# EAGLE design LESR (EAGLE 9.5.2)
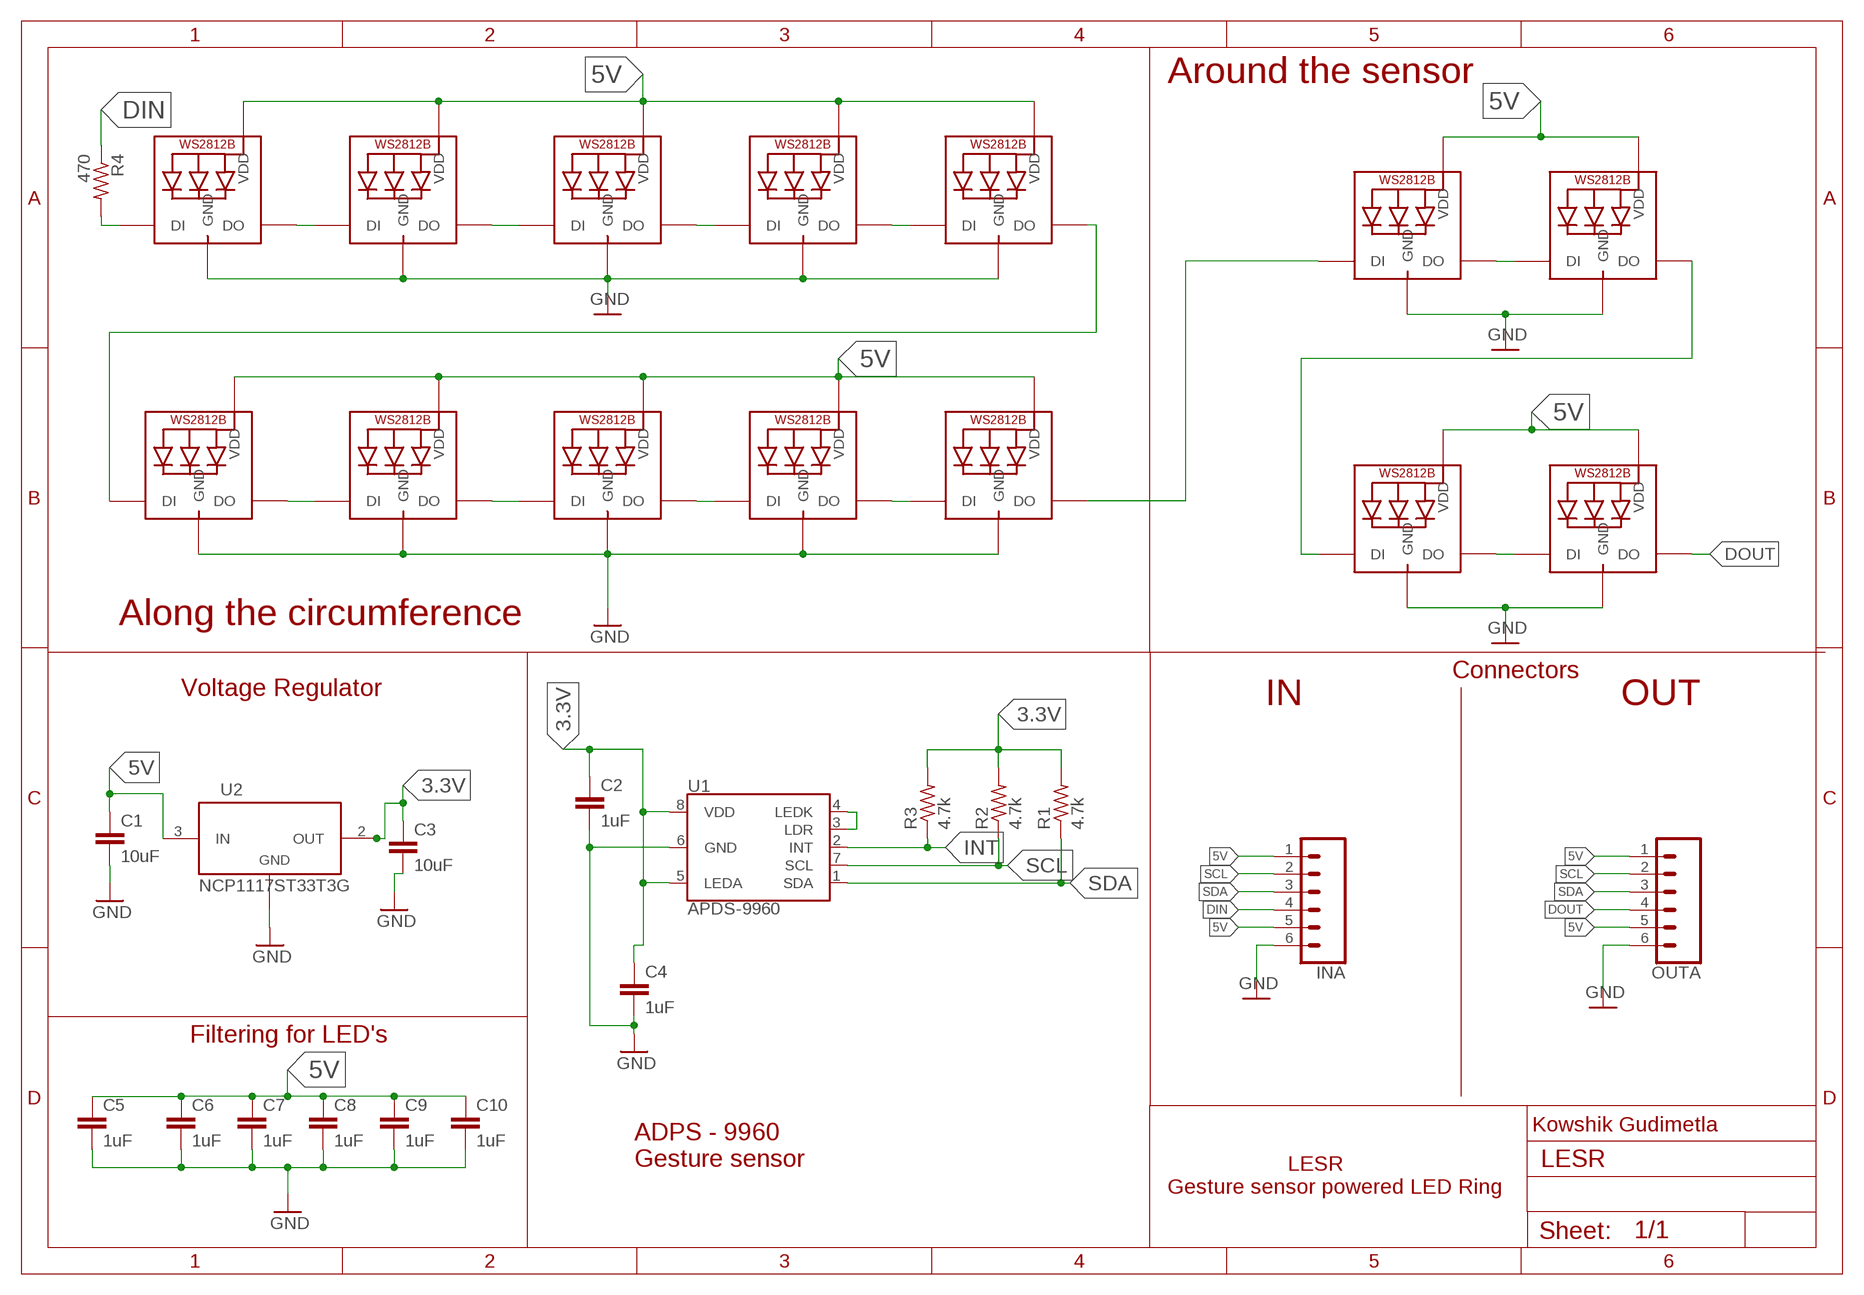
[diagram p0: schematic, sheet 1]

## Parts
C1  10uF  C-EUC0603  [C0603]
C2  1uF  C-EUC0603  [C0603]
C3  10uF  C-EUC0603  [C0603]
C4  1uF  C-EUC0603  [C0603]
C5  1uF  C-EUC0603  [C0603]
C6  1uF  C-EUC0603  [C0603]
C7  1uF  C-EUC0603  [C0603]
C8  1uF  C-EUC0603  [C0603]
C9  1uF  C-EUC0603  [C0603]
C10  1uF  C-EUC0603  [C0603]
IN  BM06B-SRSS-TB  JST_6_PIN_HORIZONTAL  [JST-6-SMD-HORI-1.0MM]
LED1  WS2812B5050  [WS2812B]
LED2  WS2812B5050  [WS2812B]
LED3  WS2812B5050  [WS2812B]
LED4  WS2812B5050  [WS2812B]
LED5  WS2812B5050  [WS2812B]
LED6  WS2812B5050  [WS2812B]
LED7  WS2812B5050  [WS2812B]
LED8  WS2812B5050  [WS2812B]
LED9  WS2812B5050  [WS2812B]
LED10  WS2812B5050  [WS2812B]
LED11  WS2812B5050  [WS2812B]
LED12  WS2812B5050  [WS2812B]
LED13  WS2812B5050  [WS2812B]
LED14  WS2812B5050  [WS2812B]
OUT  BM06B-SRSS-TB  JST_6_PIN_HORIZONTAL  [JST-6-SMD-HORI-1.0MM]
R1  4.7k  R-US_R0603  [R0603]
R2  4.7k  R-US_R0603  [R0603]
R3  4.7k  R-US_R0603  [R0603]
R4  470  R-US_R0603  [R0603]
U1  APDS-9960  [APDS-9960]
U2  NCP1117ST33T3G  [SOT-223]

## Nets
3.3V: C2.1 C3.1 C4.1 R1.2 R2.2 R3.2 U1.5(LEDA) U1.8(VDD) U2.2(OUT) U2.4
5V: C1.1 C5.1 C6.1 C7.1 C8.1 C9.1 C10.1 IN.1 IN.5 LED1.1-VDD(VDD) LED2.1-VDD(VDD) LED3.1-VDD(VDD) LED4.1-VDD(VDD) LED5.1-VDD(VDD) LED6.1-VDD(VDD) LED7.1-VDD(VDD) LED8.1-VDD(VDD) LED9.1-VDD(VDD) LED10.1-VDD(VDD) LED11.1-VDD(VDD) LED12.1-VDD(VDD) LED13.1-VDD(VDD) LED14.1-VDD(VDD) OUT.1 OUT.5 U2.3(IN)
DIN: IN.4 R4.1
DOUT: LED14.2-DOUT(DO) OUT.4
GND: C1.2 C2.2 C3.2 C4.2 C5.2 C6.2 C7.2 C8.2 C9.2 C10.2 IN.6 LED1.3-GND(GND) LED2.3-GND(GND) LED3.3-GND(GND) LED4.3-GND(GND) LED5.3-GND(GND) LED6.3-GND(GND) LED7.3-GND(GND) LED8.3-GND(GND) LED9.3-GND(GND) LED10.3-GND(GND) LED11.3-GND(GND) LED12.3-GND(GND) LED13.3-GND(GND) LED14.3-GND(GND) OUT.6 U1.6(GND) U2.1(ADJ/GND)
INT: R3.1 U1.2(INT)
N$1: LED1.4-DIN(DI) R4.2
N$2: U1.3(LDR) U1.4(LEDK)
N$10: LED6.2-DOUT(DO) LED7.4-DIN(DI)
N$11: LED7.2-DOUT(DO) LED8.4-DIN(DI)
N$12: LED8.2-DOUT(DO) LED9.4-DIN(DI)
N$13: LED9.2-DOUT(DO) LED10.4-DIN(DI)
N$14: LED1.2-DOUT(DO) LED2.4-DIN(DI)
N$15: LED2.2-DOUT(DO) LED3.4-DIN(DI)
N$16: LED3.2-DOUT(DO) LED4.4-DIN(DI)
N$17: LED4.2-DOUT(DO) LED5.4-DIN(DI)
N$18: LED11.2-DOUT(DO) LED12.4-DIN(DI)
N$19: LED13.2-DOUT(DO) LED14.4-DIN(DI)
N$20: LED12.2-DOUT(DO) LED13.4-DIN(DI)
N$21: LED5.2-DOUT(DO) LED6.4-DIN(DI)
N$22: LED10.2-DOUT(DO) LED11.4-DIN(DI)
SCL: IN.2 OUT.2 R2.1 U1.7(SCL)
SDA: IN.3 OUT.3 R1.1 U1.1(SDA)
Unconnected: IN.M1 IN.M2 OUT.M1 OUT.M2

## Notes on the sheet
- Around the sensor
- Along the circumference
- Connectors
- Voltage Regulator
- IN | OUT
- Filtering for LED's
- Kowshik Gudimetla
- ADPS - 9960 
  Gesture sensor
- LESR 
  Gesture sensor powered LED Ring

## Library data of the parts
C1-C10 = rcl:C-EU: CAPACITOR, European symbol; SPICEPREFIX: C
IN OUT = SparkFun-Connectors:JST_6_PIN_HORIZONTAL: JST 6 pin horizontal connector JST-SH type. Here is the connector we sell at SparkFun: name <link> (XXX-00000) Datasheet <http://www.sparkfun.com/datasheets/GPS/EM406-SMDConnector-eSH.pdf> It was used on these SparkFun products: name <link> (XXX-00000) name <link> (XXX-00000); PROD_ID: XXX-00000
LED1-LED14 = WS2812B:WS2812B; AVAILABILITY: Unavailable; DESCRIPTION: Raspberry Pi HAT _40 pin_ Wheeled Robotics Kit; MF: SparkFun Electronics; MP: WS2812B; PACKAGE: None; PRICE: None
R1-R4 = rcl:R-US_: RESISTOR, American symbol; SPICEPREFIX: R
U1 = APDS-9960:APDS-9960: Avago APDS-9960 Digital Proximity, Ambient Light, RGB, and Gesture Sensor. The APDS-9960 offers ambient light and color measuring, proximity detection, and touchless gesture sensing. It features UV and IR blocking filters, four separate diodes sensitive to different directions, and an I2C compatible interface. Datasheet <https://cdn.sparkfun.com/datasheets/Sensors/Proximity/apds9960.pdf> SparkFun Products SparkFun RGB and Gesture Sensor - APDS-9960 <https://www.sparkfun.com/products/12787> (SEN-12787); AVAILABILITY: Unavailable; DESCRIPTION: Optical Sensor Ambient 560nm I²C 8-SMD Module; MF: Broadcom Limited; MP: APDS-9960; PACKAGE: SMD-8 Broadcom; PRICE: None
U2 = IC:NCP1117ST33T3G: IC REG LINEAR 3.3V 1A SOT223 Manufacturer's datasheet <https://www.onsemi.com/pub/Collateral/NCP1117-D.PDF>; CREATED_BY: PCBLayout.com; DIGIKEY_PART_NUMBER: NCP1117ST33T3GOSTR-ND; MANUFACTURER: ON Semiconductor; MPN: NCP1117ST33T3G; PACKAGE: SOT-223

## Board
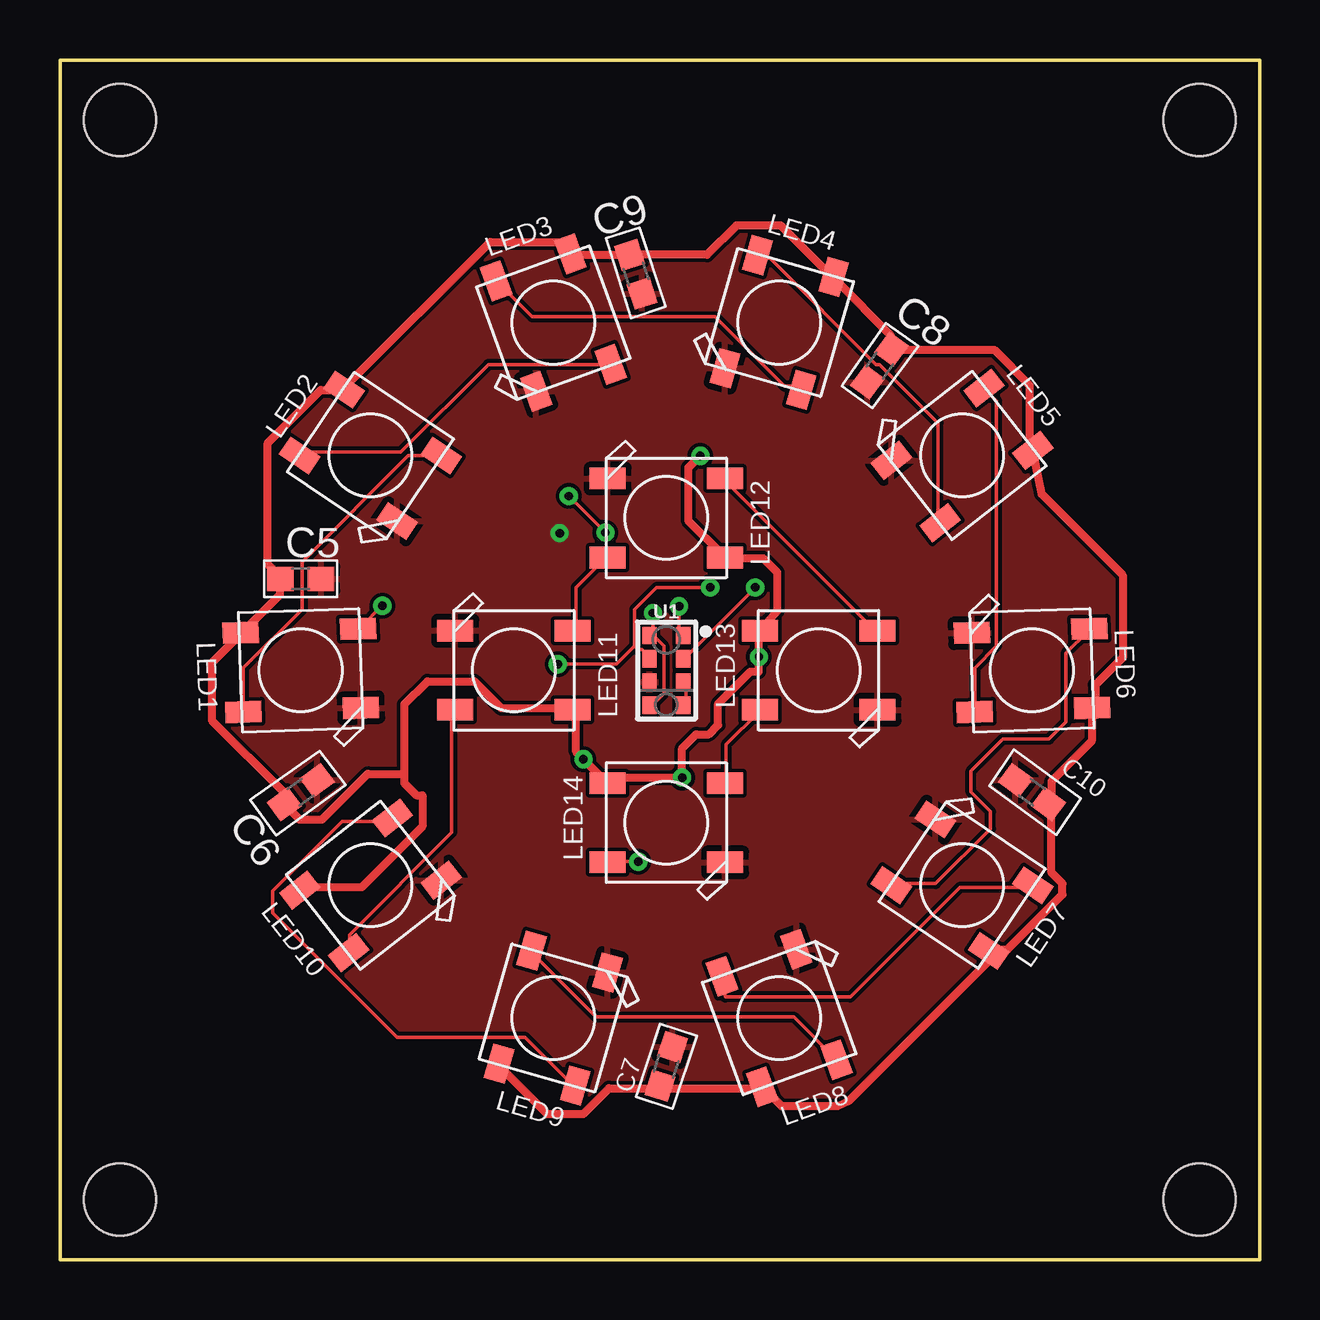
[diagram p1: board, top side]
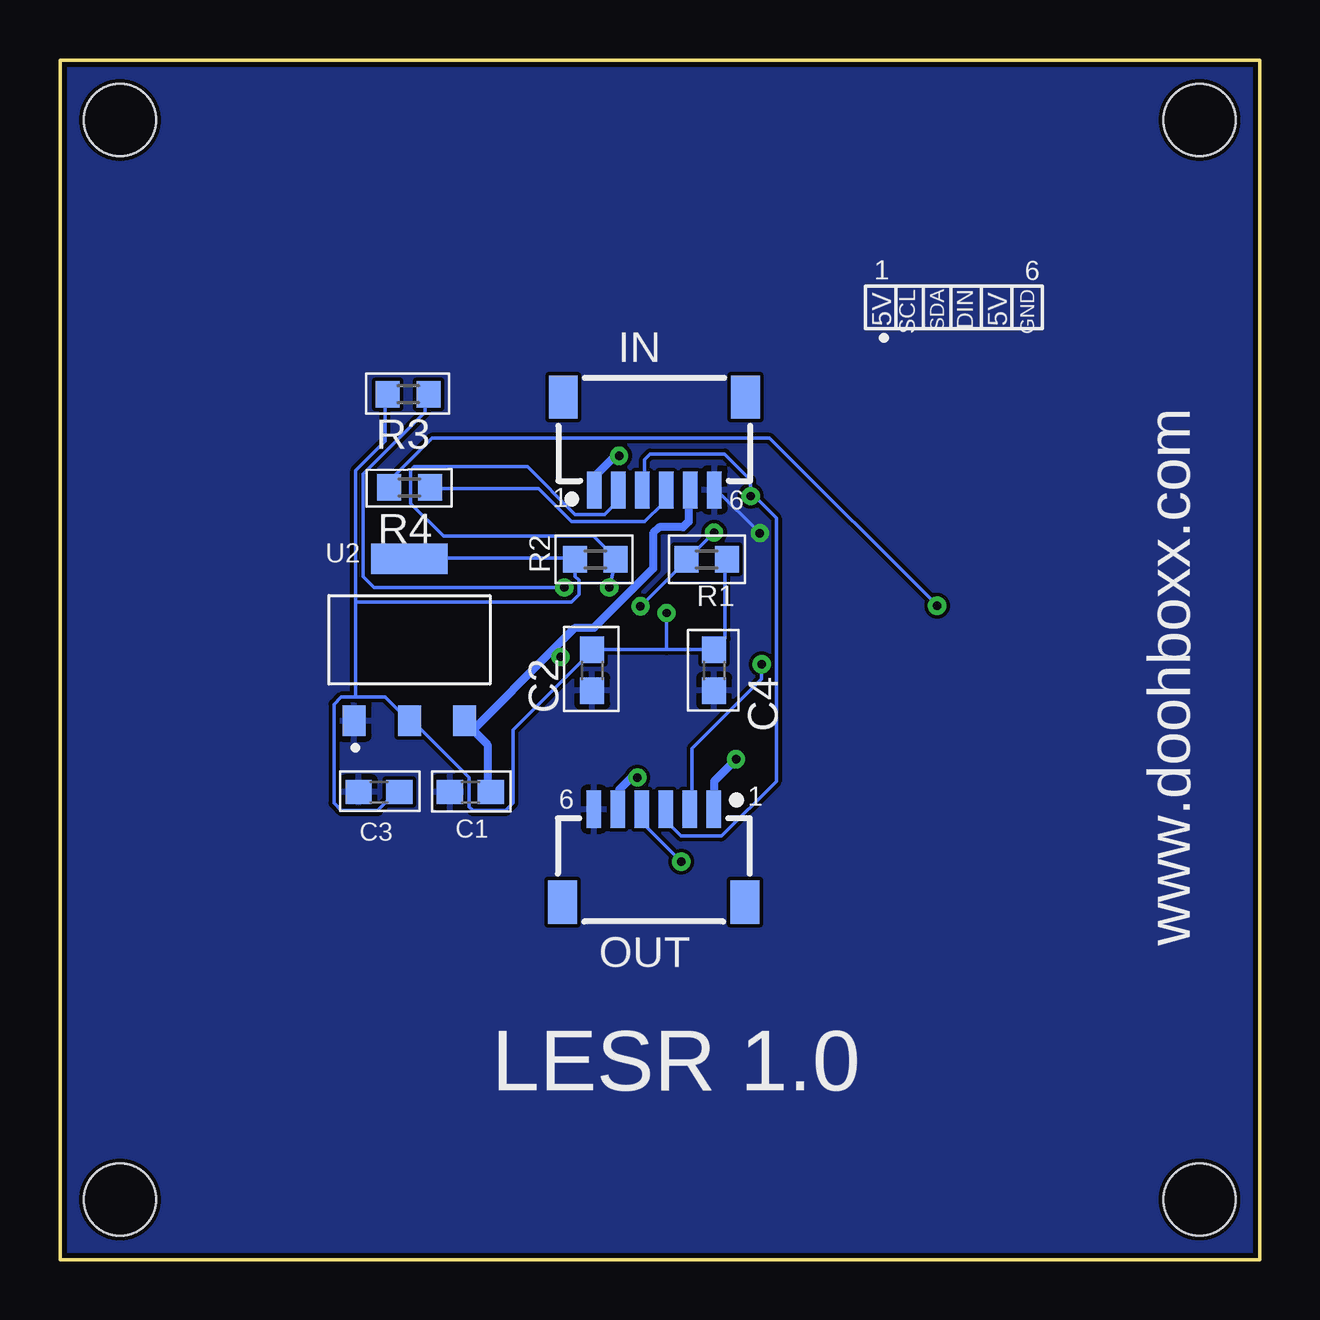
[diagram p2: board, bottom side, seen from below]

Size 50 x 50 mm. Coordinates in mm from the lower left corner, seen from the top.
Outline: 0,50 50,50 50,0 0,0 0,50
Copper layers (1*16): Top 0.035mm / dielectric 1.5mm / Bottom 0.035mm
Design rules "default *": minimum track width 6mil, minimum drill 0.35mm, track to track 6mil, track to pad 6mil, pad to pad 6mil, via to via 6mil, smd to smd 6mil, copper to edge 8mil, drill to drill 6mil, minimum pad ring 10mil, minimum via ring 8mil, stop-mask expansion 4mil, vias tented up to drill 0mil, thermal gap 10mil
Holes 3 mm at 2.5,47.5 47.5,47.5 47.5,2.5 2.5,2.5

### Footprints (pad centres in the part's own frame; a part is rotated, then mirrored left to right if it is on the bottom)
C0603 = smd 1.1 x 1: 1 -0.85,0; 2 0.85,0
JST-6-SMD-HORI-1.0MM = smd 0.6 x 1.55: 1 -2.5,-4.775; 2 -1.5,-4.775; 3 -0.5,-4.775; 4 0.5,-4.775; 5 1.5,-4.775; 6 2.5,-4.775 | smd 1.2 x 1.8: M1 -3.8,-0.9; M2 3.8,-0.9
WS2812B = smd 1.5 x 0.9: 1-VDD 2.45,-1.65; 2-DOUT 2.45,1.65; 3-GND -2.45,1.65; 4-DIN -2.45,-1.65
R0603 = smd 1 x 1.1: 1 -0.85,0; 2 0.85,0
APDS-9960 = smd 0.6 x 0.72: 1 0.7,1.455; 2 0.7,0.485; 3 0.7,-0.485; 4 0.7,-1.455; 5 -0.7,-1.455; 6 -0.7,-0.485; 7 -0.7,0.485; 8 -0.7,1.455
SOT-223 = smd 0.96 x 1.26: 1 -2.3,-3.375; 2 0,-3.375; 3 2.3,-3.375 | smd 3.19 x 1.26: 4 0,3.375

### Placement (x,y rotation side)
C1  32.89,19.48 180 bottom
C2  27.81,24.56 270 bottom
C3  36.7,19.48 180 bottom
C4  22.73,24.56 270 bottom
C5  10.03,28.37 0 top
C6  10.03,19.48 36 top
C7  25.27,8.05 72 top
C8  34.16,37.26 234 top
C9  24,41.07 288 top
C10  40.51,19.48 144 top
IN  25.22,36.85 0 bottom
LED1  10.03,24.56 182 top
LED2  12.94,33.52 146 top
LED3  20.56,39.05 110 top
LED4  29.98,39.05 74 top
LED5  37.6,33.52 38 top
LED6  40.51,24.56 2 top
LED7  37.6,15.6 326 top
LED8  29.98,10.07 290 top
LED9  20.56,10.07 254 top
LED10  12.94,15.6 218 top
LED11  18.92,24.56 0 top
LED12  25.27,30.91 0 top
LED13  31.62,24.56 180 top
LED14  25.27,18.21 180 top
OUT  25.25,13.99 180 bottom
R1  23.04,29.18 0 bottom
R2  27.69,29.18 180 bottom
R3  35.48,36.07 180 bottom
R4  35.43,32.18 180 bottom
U1  25.27,24.56 0 top
U2  35.43,25.83 0 bottom

### Tracks (layer width: path | path; a pad name or v marks a point on that pad's centre or on a via)
3.3V  (via drill 0.35)
  Top 0.152: 24.71,26.03 25.17,25.58 25.17,23.59 24.71,23.14 U1.5 | v24.71,26.95 24.71,26.03 | 24.71,26.03 U1.8
  Bottom 0.152: U2.4 35.38,29.23 28.68,29.23 R2.2 28.52,29.08 28.52,28.47 28.37,28.32 28.37,27.71 28.68,27.41 37.67,27.41 | 22.73,25.42 22.28,25.88 22.28,29.08 R1.2 | 22.73,25.42 24.71,25.42 | 24.71,25.42 27.76,25.42 C2.1 27.91,25.27 31.11,22.07 31.11,19.02 31.42,18.72 32.79,18.72 32.94,18.87 32.94,20.09 35.38,22.53 U2.2 35.53,22.53 36.45,23.44 37.67,23.44 | 22.73,25.42 C4.1 | 24.71,25.42 v24.71,26.95 | 37.67,23.44 38.28,23.44 38.58,23.14 38.58,19.02 38.28,18.72 36.75,18.72 35.99,19.48 C3.1 | 37.67,23.44 37.67,27.41 | 37.67,27.41 37.67,32.89 36.45,34.11 36.45,35.94 R3.2
5V  (via drill 0.35)
  Top 0.33: LED9.1-VDD 18.31,8.05 20.3,6.07 21.82,6.07 22.89,7.14 24.87,7.14 C7.1 25.02,7.14 29.21,7.14 LED8.1-VDD 30.07,6.4 32.42,6.4 32.88,6.61 38.71,12.45 LED7.1-VDD 38.73,12.93 39.5,12.93 41.78,15.21 41.78,15.67 41.33,16.13 41.33,18.87 C10.1 41.33,19.02 41.33,19.94 43,21.61 43,22.98 LED6.1-VDD 43.16,23.14 43.16,23.95 44.3,25.09 44.3,28.52 40.92,31.9 LED5.1-VDD 40.41,33.81 40.41,36.45 38.94,37.92 34.77,37.92 C8.1 34.62,38.07 34.62,38.53 32.33,40.82 LED4.1-VDD 32.18,40.97 30.05,43.1 28.19,43.1 26.98,41.88 23.8,41.88 C9.1 23.65,41.88 21.36,41.88 LED3.1-VDD 20.99,42.42 17.93,42.42 11.91,36.4 LED2.1-VDD 11.76,36.24 10.87,36.24 8.66,34.03 8.66,28.98 9.17,28.47 C5.1 9.17,28.32 9.17,27.71 7.64,26.19 LED1.1-VDD 7.49,26.03 6.33,24.86 6.33,22.48 9.32,19.48 9.32,19.02 C6.1 9.99,18.34 10.92,18.34 12.83,20.24 14.35,20.24 | v26.7,33.5 26.19,32.99 26.19,30.81 27.61,29.39 LED12.1-VDD 27.76,29.23 29.31,29.23 29.9,28.65 29.9,27.03 LED13.1-VDD 29.13,26.19 v29.13,25.12 29.13,24.51 28.78,24.51 27.43,23.16 27.43,22.27 27.05,21.89 26.52,21.89 25.93,21.31 v25.93,20.09 23.04,20.09 22.89,19.94 LED14.1-VDD 22.73,19.94 v21.82,20.85 21.51,21.16 21.51,22.83 LED11.1-VDD 21.36,22.98 18.39,22.98 17.27,24.1 15.32,24.1 14.35,23.14 14.35,20.24 | LED10.1-VDD 10.08,15.52 12.57,15.52 15.11,18.06 15.11,19.35 14.86,19.35 14.35,19.86 14.35,20.24
  Bottom 0.33: 32.79,22.07 33.1,22.38 U2.3 32.79,22.07 | 32.79,22.07 32.18,21.46 32.18,19.48 C1.1 | 32.79,22.07 29.44,25.42 | 29.44,25.42 28.52,26.34 27.74,26.34 25.27,28.8 25.27,30.27 25.02,30.53 24.03,30.53 23.8,30.76 23.8,31.98 IN.5 | v26.7,33.5 26.85,33.5 27.61,32.74 27.61,32.13 IN.1 | v21.82,20.85 22.73,19.94 22.73,18.87 OUT.1 | v25.93,20.09 26.19,20.09 26.7,19.58 26.7,18.87 OUT.5 | v29.13,25.12 29.44,25.42
DIN
  Bottom 0.152: R4.1 34.47,32.13 30.05,32.13 28.68,30.76 25.63,30.76 24.87,31.52 24.87,31.98 IN.4
DOUT  (via drill 0.35)
  Top 0.152: v24.11,16.58 22.89,16.58 LED14.2-DOUT
  Bottom 0.152: v24.11,16.58 25.63,18.11 25.63,18.72 OUT.4
GND  (via drill 0.35)
  Bottom 0.152: v20.83,30.27 22.63,32.08 IN.6
  pour Top: -3.5,53 52,53 52,-1.5 -4,-1.5 -4,53
  pour Bottom: -2.5,52 54,52 54,-2.5 -2.5,-2.5
INT  (via drill 0.35)
  Top 0.152: v28.98,28.01 26.09,25.12 U1.2
  Bottom 0.152: v28.98,28.01 36.91,28.01 37.36,28.47 37.36,32.74 34.77,35.33 34.77,35.94 R3.1
N$1  (via drill 0.35)
  Top 0.152: v13.44,27.25 12.52,26.34 LED1.4-DIN
  Bottom 0.152: v13.44,27.25 20.42,34.24 34.49,34.24 36.14,32.59 36.14,32.28 R4.2
N$2
  Top 0.152: U1.4 26.09,23.14 26.09,24.05 U1.3
N$10
  Top 0.152: LED7.4-DIN 34.77,15.67 36.5,15.67 38.79,17.96 38.79,18.67 37.97,19.48 37.97,20.37 39.29,21.69 41.22,21.69 41.94,22.4 41.94,25.27 42.85,26.19 LED6.2-DOUT
N$11
  Top 0.152: LED8.4-DIN 27.73,10.95 32.94,10.95 37.52,15.52 40.41,15.52 LED7.2-DOUT
N$12
  Top 0.152: LED9.4-DIN 19.68,12.77 22.35,10.11 30.59,10.11 LED8.2-DOUT
N$13
  Top 0.152: LED10.4-DIN 13.74,18.26 11.76,18.26 8.87,15.37 8.87,14.45 14.05,9.27 19.38,9.27 21.36,7.29 LED9.2-DOUT
N$14
  Top 0.152: LED1.2-DOUT 7.64,24.66 10.08,27.1 10.08,29.08 14.5,33.5 15.88,33.5 LED2.4-DIN
N$15
  Top 0.152: LED2.2-DOUT 10.08,33.65 14.2,33.65 17.86,37.31 22.89,37.31 LED3.4-DIN
N$16
  Top 0.152: LED4.4-DIN 30.81,36.4 30.2,36.4 27.3,39.29 19.68,39.29 18.31,40.66 LED3.2-DOUT
N$17
  Top 0.152: LED4.2-DOUT 29.13,41.73 29.59,41.73 34.01,37.31 34.16,37.31 36.6,34.87 36.6,30.76 LED5.4-DIN
N$18
  Top 0.152: LED11.2-DOUT 21.51,26.34 21.51,28.01 22.73,29.23 LED12.4-DIN
N$19
  Top 0.152: LED14.4-DIN 27.76,19.94 27.76,21.46 29.13,22.83 LED13.2-DOUT
N$20
  Top 0.152: LED12.2-DOUT 27.76,32.43 34.01,26.19 LED13.4-DIN
N$21
  Top 0.152: LED6.4-DIN 38.12,24.66 39.04,25.58 39.04,35.79 38.58,36.24 LED5.2-DOUT
N$22
  Top 0.152: LED10.2-DOUT 12.06,12.93 12.06,13.54 16.33,17.8 16.33,22.83 LED11.4-DIN
SCL  (via drill 0.35)
  Top 0.152: 23.95,25.58 24.11,25.42 24.26,25.42 24.56,25.12 U1.7 | 23.95,25.58 23.95,27.1 24.87,28.01 v27.1,28.01 | v20.75,24.81 23.19,24.81 23.95,25.58
  Bottom 0.152: v27.1,28.01 26.84,29.11 R2.1 26.85,29.23 27.76,30.15 34.01,30.15 35.38,31.52 35.38,32.89 35.23,33.04 30.5,33.04 28.52,31.06 27.3,31.06 26.85,31.52 26.85,31.98 IN.2 | v20.75,24.81 20.75,24.2 23.65,21.31 23.65,18.87 OUT.2
SDA  (via drill 0.35)
  Top 0.152: v25.81,27.23 25.81,26.09 U1.1 | v21.21,31.82 v22.73,30.3
  Bottom 0.152: v25.81,27.23 23.95,29.08 R1.1 23.8,29.23 v22.73,30.3 | OUT.3 24.71,18.72 24.71,18.26 24.11,17.65 22.43,17.65 20.14,19.94 20.14,30.91 21.06,31.82 v21.21,31.82 21.21,32.48 22.3,33.58 25.4,33.58 25.63,33.35 25.63,32.13 IN.3

### Text on the board
bPlace: 6 | 1 | GND | 5V | DIN | SDA | SCL | 5V | 6 | 1 | 1 | 6
bNames: www.doohboxx.com | LESR 1.0